# EAGLE design ionode (EAGLE 7.3.0)
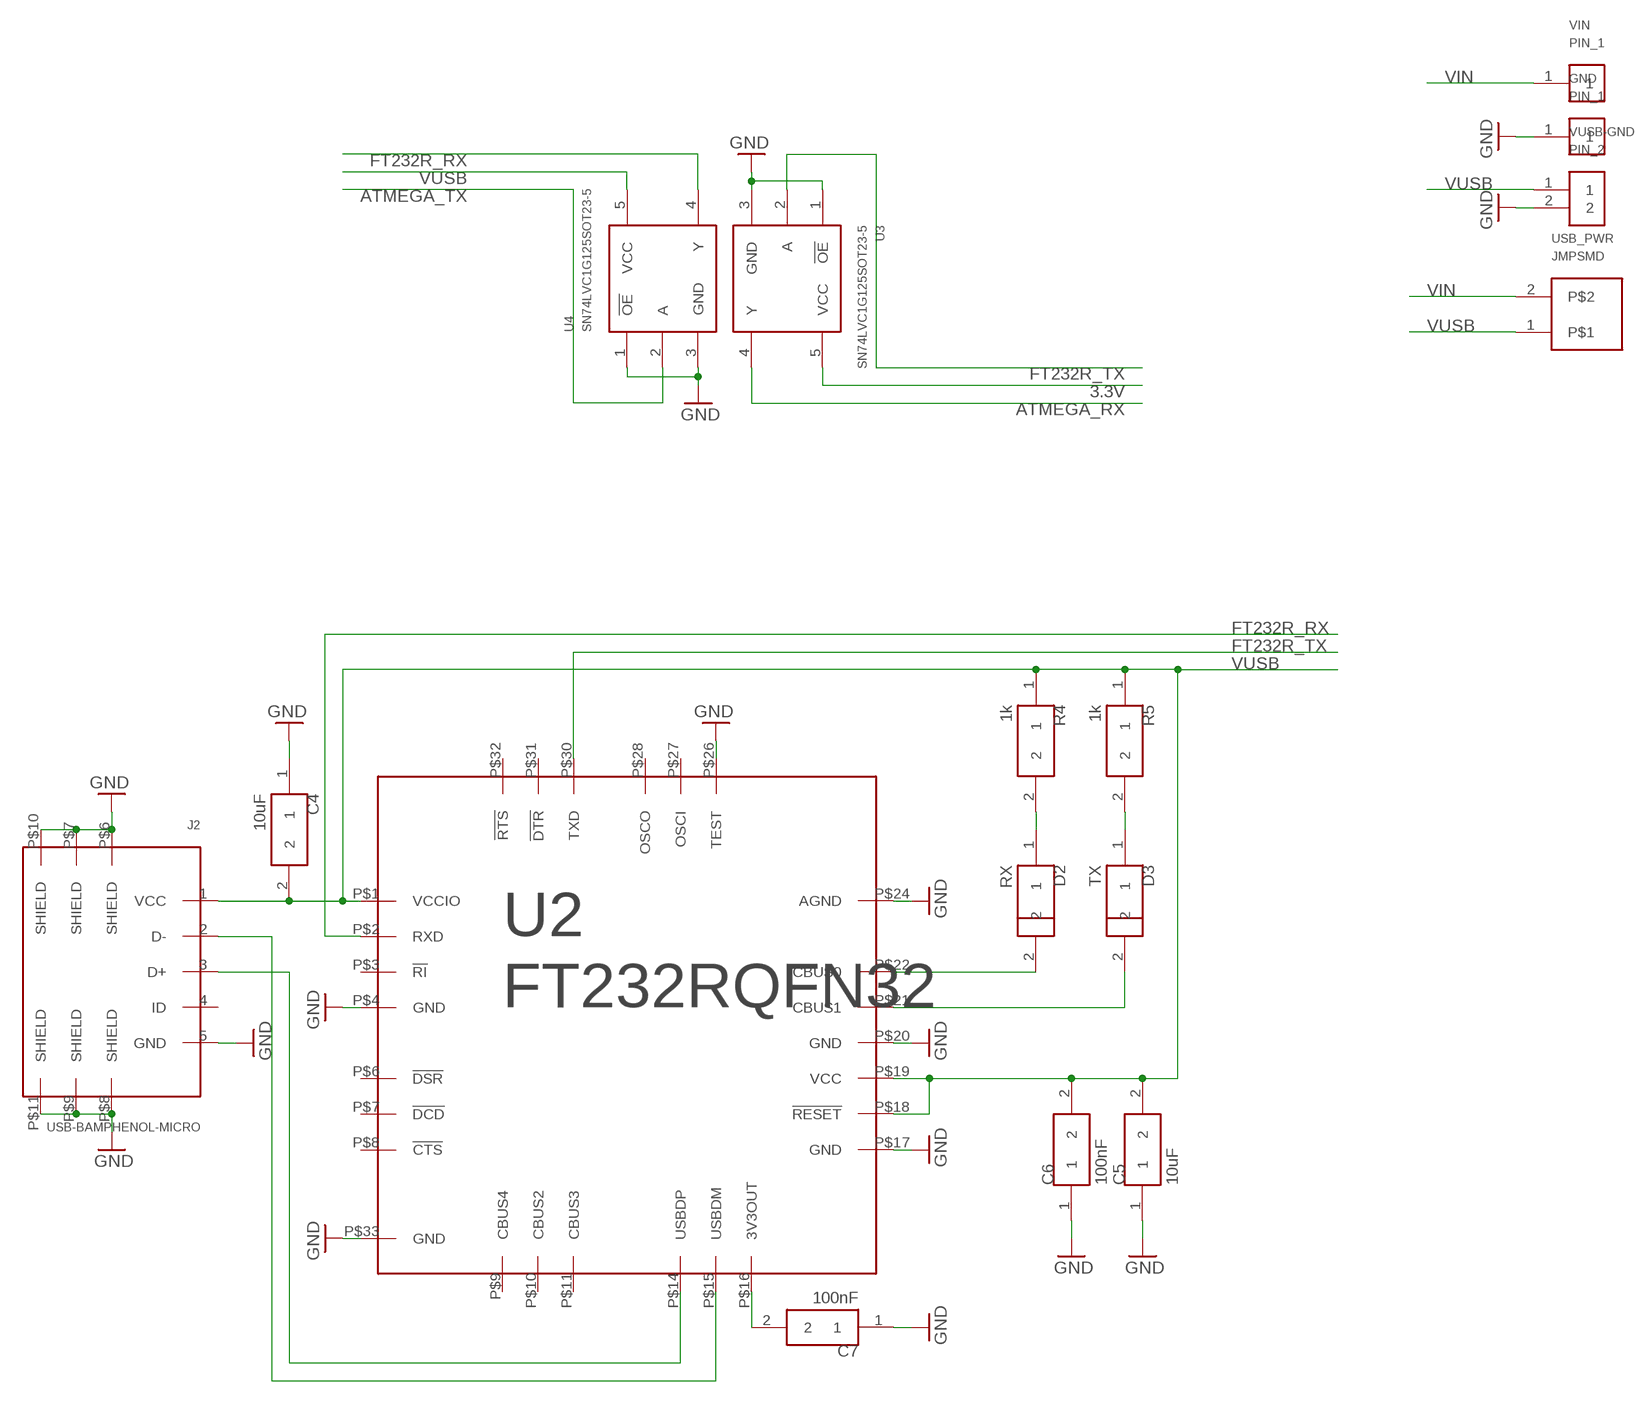
[diagram p0: schematic, sheet 1, part 1 of 2]
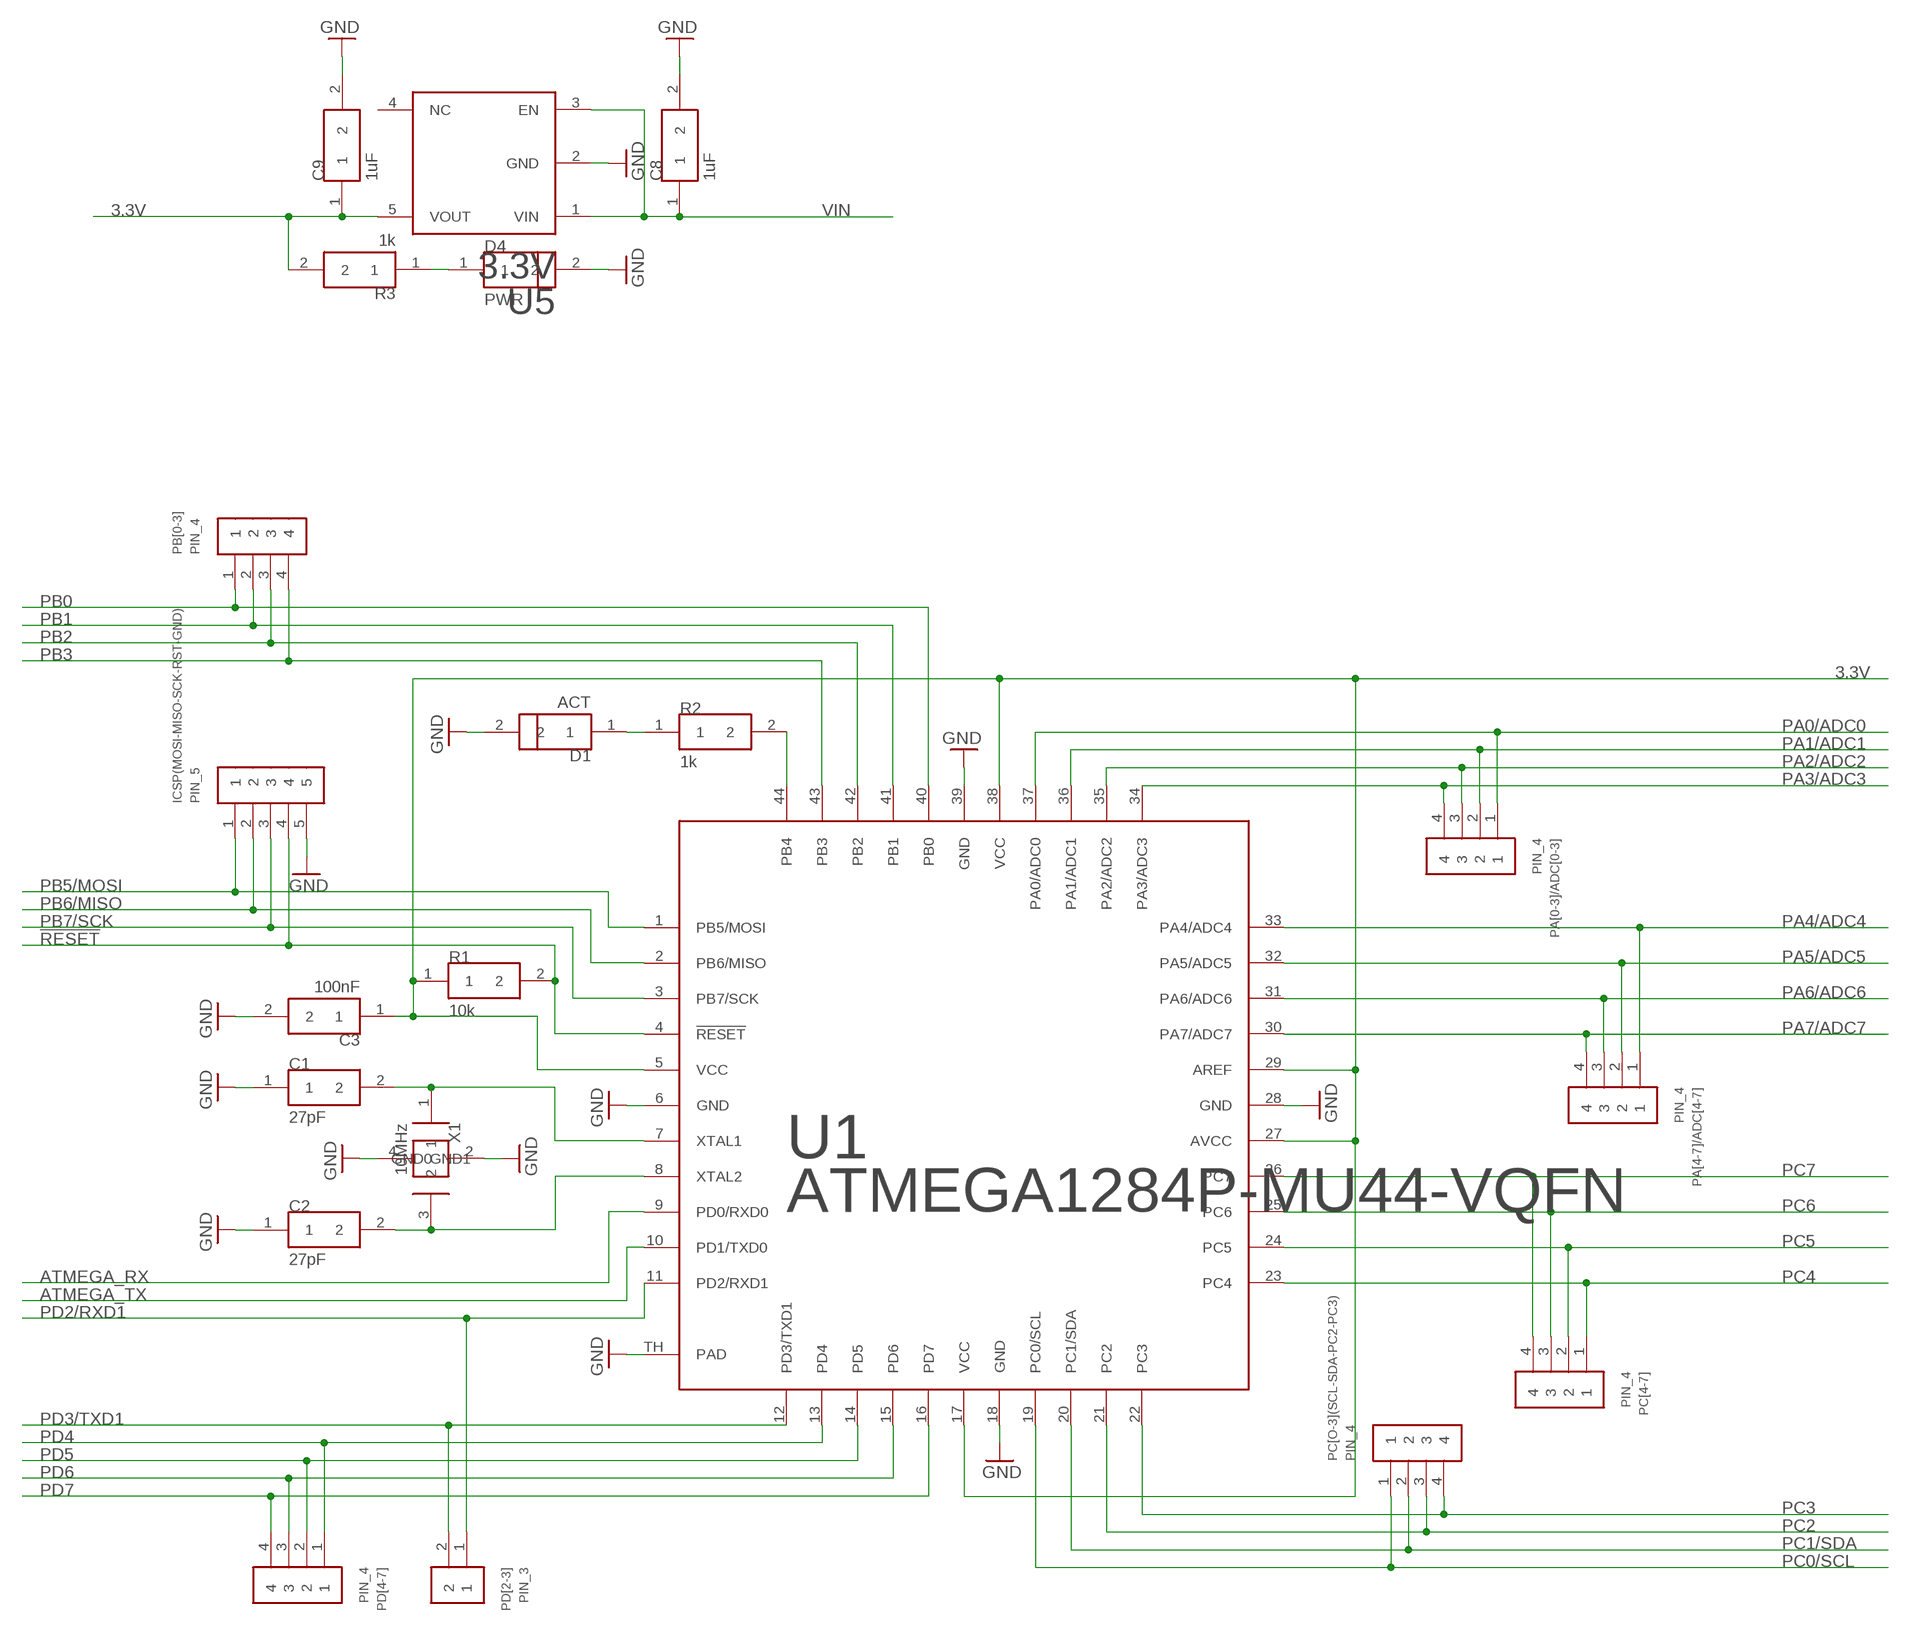
[diagram p1: schematic, sheet 1, part 2 of 2]

## Parts
C1  27pF  CAP0402  [0402]
C2  27pF  CAP0402  [0402]
C3  100nF  CAP0402  [0402]
C4  10uF  CAP0805  [0805]
C5  10uF  CAP0805  [0805]
C6  100nF  CAP0402  [0402]
C7  100nF  CAP0402  [0402]
C8  1uF  CAP0402  [0402]
C9  1uF  CAP0402  [0402]
D1  ACT  LED0402  [0402]
D2  RX  LED0402  [0402]
D3  TX  LED0402  [0402]
D4  PWR  LED0402  [0402]
GND  PIN_1  [PIN_1]
ICSP(MOSI-MISO-SCK-RST-GND)  PIN_5  [PIN_5]
J2  USB-BAMPHENOL-MICRO  [AMPHENOL-USB-MICRO-B]
PA[0-3]/ADC[0-3]  PIN_4  [PIN_4]
PA[4-7]/ADC[4-7]  PIN_4  [PIN_4]
PB[0-3]  PIN_4  [PIN_4]
PC[4-7]  PIN_4  [PIN_4]
PC[O-3](SCL-SDA-PC2-PC3)  PIN_4  [PIN_4]
PD[4-7]  PIN_4  [PIN_4]
PIN_3  PD[2-3]  PIN_2  [PIN_2]
R1  10k  RES0402  [0402]
R2  1k  RES0402  [0402]
R3  1k  RES0402  [0402]
R4  1k  RES0402  [0402]
R5  1k  RES0402  [0402]
U1  ATMEGA1284P-MU44-VQFN  [44-VQFN]
U2  FT232RQFN32  [32-VQFN]
U3  SN74LVC1G125SOT23-5  [SOT23-5]
U4  SN74LVC1G125SOT23-5  [SOT23-5]
U5  3.3V  LP3985SOT23-5  [SOT23-5]
USB_PWR  JMPSMD  [SMD_JMP]
VIN  PIN_1  [PIN_1]
VUSB-GND  PIN_2  [PIN_2]
X1  10MHz  XTAL_GNDSMD_3225  [XTAL_3225]

## Nets
3.3V: C3.1 C9.1 R1.1 R3.2 U1.5(VCC) U1.17(VCC) U1.27(AVCC) U1.29(AREF) U1.38(VCC) U3.5(VCC) U5.5(VOUT)
!RESET: ICSP(MOSI-MISO-SCK-RST-GND).4 R1.2 U1.4(!RESET)
ATMEGA_RX: U1.9(PD0/RXD0) U3.4(Y)
ATMEGA_TX: U1.10(PD1/TXD0) U4.2(A)
FT232R_RX: U2.P$2(RXD) U4.4(Y)
FT232R_TX: U2.P$30(TXD) U3.2(A)
GND: C1.1 C2.1 C3.2 C4.1 C5.1 C6.1 C7.1 C8.2 C9.2 D1.2 D4.2 GND.1 ICSP(MOSI-MISO-SCK-RST-GND).5 J2.5(GND) J2.P$6(SHIELD) J2.P$7(SHIELD) J2.P$8(SHIELD) J2.P$9(SHIELD) J2.P$10(SHIELD) J2.P$11(SHIELD) U1.6(GND) U1.18(GND) U1.28(GND) U1.39(GND) U1.TH(PAD) U2.P$4(GND) U2.P$17(GND) U2.P$20(GND) U2.P$24(AGND) U2.P$26(TEST) U2.P$33(GND) U3.1(!OE) U3.3(GND) U4.1(!OE) U4.3(GND) U5.2(GND) VUSB-GND.2 X1.2(GND0) X1.4(GND1)
N$1: C2.2 U1.8(XTAL2) X1.3
N$2: C1.2 U1.7(XTAL1) X1.1
N$3: D4.1 R3.1
N$5: D1.1 R2.1
N$6: R2.2 U1.44(PB4)
N$21: C7.2 U2.P$16(3V3OUT)
N$22: D2.2 U2.P$22(CBUS0)
N$23: D3.2 U2.P$21(CBUS1)
N$24: D2.1 R4.2
N$25: D3.1 R5.2
N$26: J2.2(D-) U2.P$15(USBDM)
N$27: J2.3(D+) U2.P$14(USBDP)
PA0/ADC0: PA[0-3]/ADC[0-3].1 U1.37(PA0/ADC0)
PA1/ADC1: PA[0-3]/ADC[0-3].2 U1.36(PA1/ADC1)
PA2/ADC2: PA[0-3]/ADC[0-3].3 U1.35(PA2/ADC2)
PA3/ADC3: PA[0-3]/ADC[0-3].4 U1.34(PA3/ADC3)
PA4/ADC4: PA[4-7]/ADC[4-7].1 U1.33(PA4/ADC4)
PA5/ADC5: PA[4-7]/ADC[4-7].2 U1.32(PA5/ADC5)
PA6/ADC6: PA[4-7]/ADC[4-7].3 U1.31(PA6/ADC6)
PA7/ADC7: PA[4-7]/ADC[4-7].4 U1.30(PA7/ADC7)
PB0: PB[0-3].1 U1.40(PB0)
PB1: PB[0-3].2 U1.41(PB1)
PB2: PB[0-3].3 U1.42(PB2)
PB3: PB[0-3].4 U1.43(PB3)
PB5/MOSI: ICSP(MOSI-MISO-SCK-RST-GND).1 U1.1(PB5/MOSI)
PB6/MISO: ICSP(MOSI-MISO-SCK-RST-GND).2 U1.2(PB6/MISO)
PB7/SCK: ICSP(MOSI-MISO-SCK-RST-GND).3 U1.3(PB7/SCK)
PC0/SCL: PC[O-3](SCL-SDA-PC2-PC3).1 U1.19(PC0/SCL)
PC1/SDA: PC[O-3](SCL-SDA-PC2-PC3).2 U1.20(PC1/SDA)
PC2: PC[O-3](SCL-SDA-PC2-PC3).3 U1.21(PC2)
PC3: PC[O-3](SCL-SDA-PC2-PC3).4 U1.22(PC3)
PC4: PC[4-7].1 U1.23(PC4)
PC5: PC[4-7].2 U1.24(PC5)
PC6: PC[4-7].3 U1.25(PC6)
PC7: PC[4-7].4 U1.26(PC7)
PD2/RXD1: PIN_3.1 U1.11(PD2/RXD1)
PD3/TXD1: PIN_3.2 U1.12(PD3/TXD1)
PD4: PD[4-7].1 U1.13(PD4)
PD5: PD[4-7].2 U1.14(PD5)
PD6: PD[4-7].3 U1.15(PD6)
PD7: PD[4-7].4 U1.16(PD7)
VIN: C8.1 U5.1(VIN) U5.3(EN) USB_PWR.2 VIN.1
VUSB: C4.2 C5.2 C6.2 J2.1(VCC) R4.1 R5.1 U2.P$1(VCCIO) U2.P$18(!RESET) U2.P$19(VCC) U4.5(VCC) USB_PWR.1 VUSB-GND.1
Unconnected: J2.4(ID) U2.P$3(!RI) U2.P$6(!DSR) U2.P$7(!DCD) U2.P$8(!CTS) U2.P$9(CBUS4) U2.P$10(CBUS2) U2.P$11(CBUS3) U2.P$27(OSCI) U2.P$28(OSCO) U2.P$31(!DTR) U2.P$32(!RTS) U5.4(NC)

## Library data of the parts
C1-C9 = dooba:CAP
D1-D4 = dooba:LED
GND VIN = dooba:PIN_1
ICSP(MOSI-MISO-SCK-RST-GND) = dooba:PIN_5
J2 = dooba:USB-B
PA[0-3]/ADC[0-3] PA[4-7]/ADC[4-7] PB[0-3] PC[4-7] PC[O-3](SCL-SDA-PC2-PC3) PD[4-7] = dooba:PIN_4
PIN_3 VUSB-GND = dooba:PIN_2
R1-R5 = dooba:RES
U1 = dooba:ATMEGA1284P-MU
U2 = dooba:FT232R
U3 U4 = dooba:SN74LVC1G125
U5 = dooba:LP3985
USB_PWR = dooba:JMP
X1 = dooba:XTAL_GND

## Board
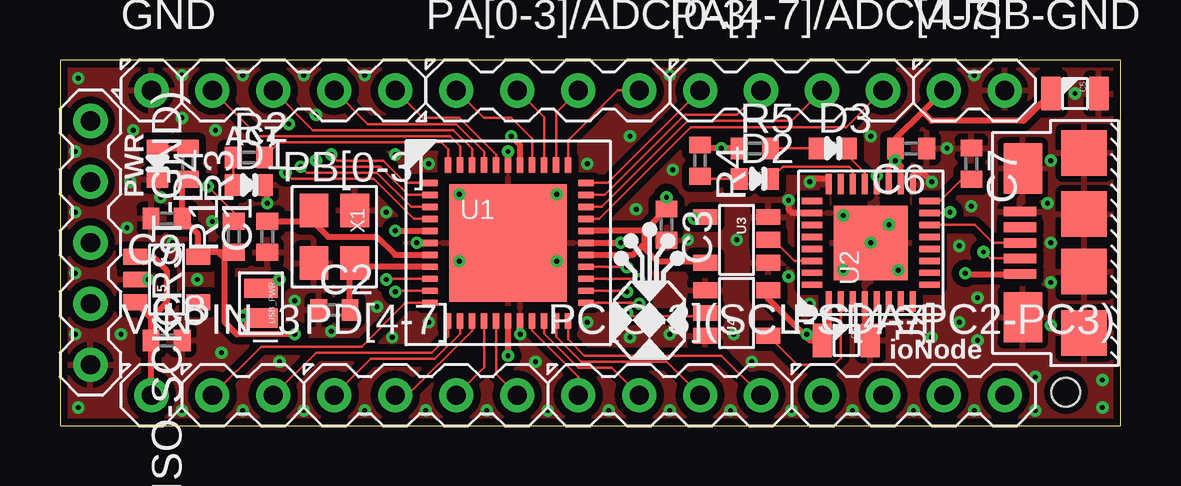
[diagram p2: board, top side]
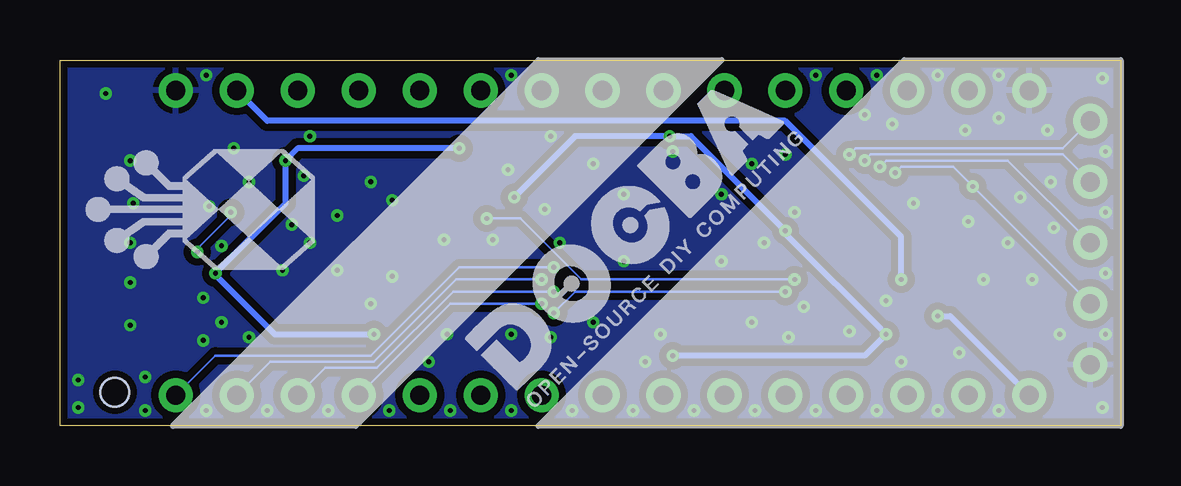
[diagram p3: board, bottom side, seen from below]

Size 44.2 x 15.24 mm. Coordinates in mm from the lower left corner, seen from the top.
Outline: 0,15.24 0,0 44.2,0 44.2,15.24 0,15.24
Copper layers (1*16): Top 0.035mm / dielectric 1.5mm / Bottom 0.035mm
Design rules "dooba-zfpcba *": minimum track width 4mil, minimum drill 8mil, track to track 4mil, track to pad 4mil, pad to pad 4mil, via to via 4mil, smd to smd 0mil, copper to edge 10mil, drill to drill 10mil, minimum pad ring 5mil, minimum via ring 6mil, stop-mask expansion 2mil, vias tented up to drill 25mil, thermal gap 10mil
Holes 1.2 mm at 41.91,1.4

### Footprints (pad centres in the part's own frame; a part is rotated, then mirrored left to right if it is on the bottom)
0402 = smd 0.7 x 0.9: 1 -0.65,0; 2 0.65,0
0805 = smd 0.8 x 1.4: 1 -1,0; 2 1,0
PIN_1 = drill 0.8 pad 1.422: 1 0,0
PIN_5 = drill 0.8 pad 1.422: 1 -5.08,0; 2 -2.54,0; 3 0,0; 4 2.54,0; 5 5.08,0
AMPHENOL-USB-MICRO-B = smd 0.4 x 1.35: 1 -1.3,2.675; 2 -0.65,2.675; 3 0,2.675; 4 0.65,2.675; 5 1.3,2.675 | smd 1.9 x 1.9: P$6 -1.2,0; P$7 1.2,0; P$8 -3.75,0; P$9 3.75,0 | smd 2.1 x 1.6: P$10 -3.1,2.55; P$11 3.1,2.55
PIN_4 = drill 0.8 pad 1.422: 1 -3.81,0; 2 -1.27,0; 3 1.27,0; 4 3.81,0
PIN_2 = drill 0.8 pad 1.422: 1 -1.27,0; 2 1.27,0
44-VQFN = smd 0.65 x 0.26: 1 -3.25,2.5; 2 -3.25,2; 3 -3.25,1.5; 4 -3.25,1; 5 -3.25,0.5; 6 -3.25,0; 7 -3.25,-0.5; 8 -3.25,-1; 9 -3.25,-1.5; 10 -3.25,-2; 11 -3.25,-2.5; 23 3.25,-2.5; 24 3.25,-2; 25 3.25,-1.5; 26 3.25,-1; 27 3.25,-0.5; 28 3.25,0; 29 3.25,0.5; 30 3.25,1; 31 3.25,1.5; 32 3.25,2; 33 3.25,2.5 | smd 0.26 x 0.65: 12 -2.5,-3.25; 13 -2,-3.25; 14 -1.5,-3.25; 15 -1,-3.25; 16 -0.5,-3.25; 17 0,-3.25; 18 0.5,-3.25; 19 1,-3.25; 20 1.5,-3.25; 21 2,-3.25; 22 2.5,-3.25; 34 2.5,3.25; 35 2,3.25; 36 1.5,3.25; 37 1,3.25; 38 0.5,3.25; 39 0,3.25; 40 -0.5,3.25; 41 -1,3.25; 42 -1.5,3.25; 43 -2,3.25; 44 -2.5,3.25 | smd 4.9 x 4.9: TH 0,0
32-VQFN = smd 0.85 x 0.26: P$1 -2.45,1.75; P$2 -2.45,1.25; P$3 -2.45,0.75; P$4 -2.45,0.25; P$5 -2.45,-0.25; P$6 -2.45,-0.75; P$7 -2.45,-1.25; P$8 -2.45,-1.75; P$17 2.45,-1.75; P$18 2.45,-1.25; P$19 2.45,-0.75; P$20 2.45,-0.25; P$21 2.45,0.25; P$22 2.45,0.75; P$23 2.45,1.25; P$24 2.45,1.75 | smd 0.26 x 0.85: P$9 -1.75,-2.45; P$10 -1.25,-2.45; P$11 -0.75,-2.45; P$12 -0.25,-2.45; P$13 0.25,-2.45; P$14 0.75,-2.45; P$15 1.25,-2.45; P$16 1.75,-2.45; P$25 1.75,2.45; P$26 1.25,2.45; P$27 0.75,2.45; P$28 0.25,2.45; P$29 -0.25,2.45; P$30 -0.75,2.45; P$31 -1.25,2.45; P$32 -1.75,2.45 | smd 3.1 x 3.1: P$33 0,0
SOT23-5 = smd 0.66 x 1: 1 0.95,1.315; 2 0,1.315; 3 -0.95,1.315; 4 -0.95,-1.315; 5 0.95,-1.315
SMD_JMP = smd 0.8 x 1.4: 1 -0.619,0; 2 0.619,0
XTAL_3225 = smd 1.4 x 1.2: 1 -1.1,-0.85; 2 1.1,-0.85; 3 1.1,0.85; 4 -1.1,0.85

### Placement (x,y rotation side)
C1  8.64,7.87 90 top
C2  11.43,4.83 0 top
C3  25.27,8.38 270 top
C4  32.77,3.56 180 top
C5  42.29,13.84 180 top
C6  35.46,11.56 180 top
C7  37.97,10.92 270 top
C8  4.45,3.56 0 top
C9  4.45,8.64 180 top
D1  7.87,10.03 0 top
D2  28.96,10.29 0 top
D3  32.21,11.56 0 top
D4  4.06,10.92 270 top
GND  3.81,13.97 0 top
ICSP(MOSI-MISO-SCK-RST-GND)  1.27,7.62 270 top
J2  42.67,7.62 90 top
PA[0-3]/ADC[0-3]  20.32,13.97 0 top
PA[4-7]/ADC[4-7]  30.48,13.97 0 top
PB[0-3]  10.16,13.97 180 top
PC[4-7]  35.56,1.27 0 top
PC[O-3](SCL-SDA-PC2-PC3)  25.4,1.27 0 top
PD[4-7]  15.24,1.27 0 top
PIN_3  7.62,1.27 0 top
R1  7.24,7.87 90 top
R2  7.87,11.18 0 top
R3  5.33,10.92 270 top
R4  26.67,11.05 270 top
R5  28.96,11.56 0 top
U1  18.67,7.62 0 top
U2  33.78,7.62 90 top
U3  28.19,7.75 270 top
U4  28.19,4.7 90 top
U5  4.45,6.1 90 top
USB_PWR  8.37,5.11 270 top
VIN  3.81,1.27 0 top
VUSB-GND  38.1,13.97 0 top
X1  11.43,7.87 270 top

### Tracks (layer width: path | path; a pad name or v marks a point on that pad's centre or on a via)
3.3V  (via drill 0.2)
  Top 0.254: 26.71,6.97 U3.5 26.82,6.86 24.89,6.86 24.36,7.39 24.36,7.6 | R1.1 6.6,7.22 | 6.6,7.22 5.94,7.22 U5.5 5.76,7.97 C9.1 5.09,10.16 R3.2 | v13.97,8.13 v13.98,8.12 U1.5 | v18.67,2.92 U1.17 | U1.38 19.17,11.69 v18.8,12.07 | v25.27,9.52 C3.1 24.36,8.12 | 24.36,8.12 U1.29 | U1.27 23.88,7.12 24.36,7.6 | 24.36,7.6 24.36,8.12 | v9.78,3.81 7.37,3.81 6.86,4.32 6.86,6.97 6.6,7.22
  Bottom 0.254: v18.67,2.92 10.67,2.92 v9.78,3.81 13.97,8 v13.97,8.13 17.91,12.07 v18.8,12.07 22.73,12.07 v25.27,9.52
!RESET  (via drill 0.2)
  Top 0.102: U1.4 14.75,8.62 13.08,10.29 9.65,10.29 v9.4,10.54 | R1.2 7.24,8.89 v6.16,9.97
  Bottom 0.102: v9.4,10.54 9.14,10.8 6.98,10.8 6.29,10.1 v6.16,9.97 ICSP(MOSI-MISO-SCK-RST-GND).4
ATMEGA_RX  (via drill 0.2)
  Top 0.102: U1.9 13.61,6.12 v13.59,6.1 | v26.42,8.64 26.82,8.64 U3.4
  Bottom 0.102: v13.59,6.1 22.48,6.1 25.02,8.64 v26.42,8.64
ATMEGA_TX  (via drill 0.2)
  Top 0.102: U1.10 14,5.62 v13.97,5.59 | v23.62,4.7 23.75,4.57 26.75,4.57 U4.2
  Bottom 0.102: v13.97,5.59 22.73,5.59 v23.62,4.7
FT232R_RX
  Top 0.102: U2.P$2 32.53,2.81 32.26,2.54 30.72,2.54 U4.4
FT232R_TX
  Top 0.102: U2.P$30 30.59,6.87 29.97,7.49 29.76,7.49 U3.2
GND  (via drill 0.2)
  Top 0.254: U1.28 v23.37,7.62 | U5.2 v3.68,6.1 | U1.39 v18.67,11.43 | U1.18 v19.17,3.82 v19.18,3.81 | U1.6 v14.86,7.62 | 30.86,8.89 30.88,8.87 U2.P$26 30.5,8.87 30.35,9.02 v30.35,9.4 | U2.P$24 32.03,10.26 32,10.29 31.37,10.29 | U2.P$20 v34.03,10.41 v34.04,10.41 | U2.P$17 35.53,10.39 35.69,10.54 35.94,10.54 v36.32,10.16 | U2.P$4 33.53,4.7 | 33.53,4.7 | v8.64,9.27 8.64,9.92 D1.2 | U1.TH 17.4,7.62 v16.64,6.86 | 33.53,4.7 33.53,3.79 C4.1
  other vias: 32.64,6.48 34.92,6.48 32.64,8.76 34.54,8.38 33.78,7.62 16.64,9.65 20.7,9.65 20.7,6.86 0.76,14.48 0.76,0.76 43.43,0.76 0.64,11.43 0.64,8.89 0.64,6.35 0.64,3.81 3.05,12.32 2.92,10.16 2.79,8.26 2.54,3.81 6.73,3.05 9.78,5.21 13.21,4.95 11.3,3.94 13.84,3.68 13.59,8.89 13.97,11.3 9.52,12.57 6.48,12.32 5.08,12.83 5.08,14.61 7.62,14.61 10.16,14.61 12.7,14.61 25.4,14.61 38.1,14.61 42.29,13.84 5.08,0.64 7.62,0.64 10.16,0.64 12.7,0.64 15.24,0.64 17.78,0.64 20.32,0.64 22.86,0.64 25.4,0.64 27.94,0.64 30.48,0.64 33.02,0.64 35.56,0.64 38.1,0.64 40.64,0.64 40.64,2.03 4.19,9.52 4.7,7.62 5.71,6.1 6.35,8.51 15.37,4.32 21.97,4.32 21.97,10.92 15.37,10.92 23.75,12.07 25.53,10.67 24,9.02 26.16,7.75 25.4,3.81 23.75,3.68 19.81,2.67 9.14,2.67 10.67,12.95 28.83,2.67 28.19,7.75 28.07,3.81 31.24,10.16 31.24,5.08 33.78,12.07 36.96,11.56 37.97,9.14 37.47,7.49 30.35,6.22 36.32,3.68 38.23,5.33 38.23,3.56 37.47,4.32 43.43,1.91 41.28,7.62 41.28,11.05 41.28,4.19 41.28,5.97 41.15,9.27
  pour Top (isolate 0.305): 44.2,15.24 44.2,0 0,0 0,15.24
  pour Bottom (isolate 0.305): 44.2,15.24 44.2,0 0,0 0,15.24
N$1
  Top 0.254: U1.8 12.43,6.62 X1.3 12.08,6.57 C2.2
N$2
  Top 0.254: U1.7 13.96,7.12 13.21,7.87 11.18,7.87 10.58,8.47 X1.1 10.13,8.52 C1.2
N$3
  Top 0.254: D4.1 R3.1
N$5
  Top 0.102: R2.1 D1.1
N$6
  Top 0.102: U1.44 16.17,11.52 15.88,11.81 9.14,11.81 8.76,11.43 R2.2
N$21
  Top 0.102: U2.P$16 36.67,9.37 37.58,10.27 C7.2
N$22
  Top 0.102: U2.P$22 33.03,10.66 32.89,10.8 30.11,10.8 D2.2
N$23
  Top 0.102: U2.P$21 33.53,10.54 32.86,11.21 D3.2
N$24
  Top 0.102: R4.2 26.78,10.29 D2.1
N$25
  Top 0.102: D3.1 R5.2
N$26  (via drill 0.2)
  Top 0.102: U2.P$15 37.06,8.87 v37.08,8.89 | v38.48,7.24 38.75,6.97 J2.2
  Bottom 0.102: v37.08,8.89 37.08,8.76 38.48,7.37 v38.48,7.24
N$27
  Top 0.102: U2.P$14 38.11,8.37 38.86,7.62 J2.3
PA0/ADC0
  Top 0.102: U1.37 19.67,11.95 18.8,12.83 17.65,12.83 PA[0-3]/ADC[0-3].1
PA1/ADC1
  Top 0.102: U1.36 20.17,12.85 PA[0-3]/ADC[0-3].2
PA2/ADC2
  Top 0.102: U1.35 20.67,13.05 PA[0-3]/ADC[0-3].3
PA3/ADC3
  Top 0.102: PA[0-3]/ADC[0-3].4 23.24,13.97 21.17,11.9 U1.34
PA4/ADC4
  Top 0.102: U1.33 22.82,10.12 PA[4-7]/ADC[4-7].1
PA5/ADC5
  Top 0.102: U1.32 22.7,9.62 26.04,12.95 28.19,12.95 PA[4-7]/ADC[4-7].2
PA6/ADC6
  Top 0.102: U1.31 22.58,9.12 26.16,12.7 30.48,12.7 PA[4-7]/ADC[4-7].3
PA7/ADC7
  Top 0.102: U1.30 22.46,8.62 26.29,12.45 32.77,12.45 PA[4-7]/ADC[4-7].4
PB0
  Top 0.102: U1.40 18.17,11.3 16.64,12.83 15.11,12.83 PB[0-3].1
PB1
  Top 0.102: U1.41 17.67,11.41 16.51,12.57 12.83,12.57 PB[0-3].2
PB2
  Top 0.102: U1.42 17.17,11.53 16.38,12.32 10.54,12.32 PB[0-3].3
PB3
  Top 0.102: PB[0-3].4 8.25,12.07 16.26,12.07 16.67,11.65 U1.43
PB5/MOSI  (via drill 0.2)
  Top 0.102: U1.1 14.39,10.12 13.46,11.05 11.56,11.05 v11.3,11.3
  Bottom 0.102: v11.3,11.3 11.05,11.56 2.41,11.56 ICSP(MOSI-MISO-SCK-RST-GND).1
PB6/MISO  (via drill 0.2)
  Top 0.102: U1.2 14.51,9.62 13.34,10.8 10.92,10.8 v10.67,11.05
  Bottom 0.102: v10.67,11.05 10.41,11.3 2.41,11.3 ICSP(MOSI-MISO-SCK-RST-GND).2
PB7/SCK  (via drill 0.2)
  Top 0.102: U1.3 14.63,9.12 13.21,10.54 10.29,10.54 v10.03,10.8
  Bottom 0.102: ICSP(MOSI-MISO-SCK-RST-GND).3 4.7,11.05 9.78,11.05 v10.03,10.8
PC0/SCL
  Top 0.102: U1.19 19.67,3.95 21.59,2.03 PC[O-3](SCL-SDA-PC2-PC3).1
PC1/SDA
  Top 0.102: U1.20 20.17,3.83 21.59,2.41 22.99,2.41 PC[O-3](SCL-SDA-PC2-PC3).2
PC2
  Top 0.102: U1.21 20.67,3.71 21.72,2.67 25.27,2.67 PC[O-3](SCL-SDA-PC2-PC3).3
PC3
  Top 0.102: U1.22 21.17,3.6 21.84,2.92 27.56,2.92 PC[O-3](SCL-SDA-PC2-PC3).4
PC4  (via drill 0.2)
  Top 0.102: U1.23 24.09,5.12 v24.13,5.08
  Bottom 0.102: v24.13,5.08 27.94,5.08 PC[4-7].1
PC5  (via drill 0.2)
  Top 0.102: U1.24 23.59,5.62 v23.62,5.59
  Bottom 0.102: PC[4-7].2 33.15,2.41 30.99,2.41 27.81,5.59 v23.62,5.59
PC6  (via drill 0.2)
  Top 0.102: U1.25 24.11,6.12 v24.13,6.1
  Bottom 0.102: PC[4-7].3 35.43,2.67 31.12,2.67 27.69,6.1 v24.13,6.1
PC7  (via drill 0.2)
  Top 0.102: U1.26 23.61,6.62 v23.62,6.6
  Bottom 0.102: PC[4-7].4 37.72,2.92 31.24,2.92 27.56,6.6 v23.62,6.6
PD2/RXD1
  Top 0.102: U1.11 14.39,5.12 12.57,3.3 8.38,3.3 PIN_3.1
PD3/TXD1
  Top 0.102: PIN_3.2 10.67,3.05 15.49,3.05 16.17,3.72 U1.12
PD4
  Top 0.102: U1.13 16.67,3.84 15.62,2.79 12.95,2.79 PD[4-7].1
PD5
  Top 0.102: U1.14 17.17,3.96 14.48,1.27 PD[4-7].2
PD6
  Top 0.102: U1.15 17.67,2.43 PD[4-7].3
PD7
  Top 0.102: U1.16 18.17,2.15 PD[4-7].4
VIN  (via drill 0.2)
  Top 0.254: VIN.1 3.81,3.54 C8.1 3.8,4.48 | 3.8,4.48 U5.3 | U5.1 3.88,7.05 4.45,6.48 4.45,5.13 3.8,4.48 | USB_PWR.2 7.7,4.49 v7.62,4.57
  Bottom 0.254: v7.62,4.57 7.11,4.57 VIN.1
VUSB  (via drill 0.2)
  Top 0.254: v34.8,11.05 v34.81,11.06 C6.2 34.81,11.95 35.94,13.08 | VUSB-GND.1 35.94,13.08 | C5.2 40.15,12.7 36.32,12.7 35.94,13.08 | U2.P$19 34.53,10.78 v34.8,11.05 | U2.P$18 35.03,10.82 v34.8,11.05 | U2.P$1 32.03,3.82 C4.2 | U4.5 29.51,5.29 31.24,3.56 C4.2 | v31.12,3.81 31.62,3.56 C4.2 | v37.72,6.35 37.75,6.32 J2.1 | R5.1 v27.56,11.56 26.81,11.56 R4.1 | USB_PWR.1 8.78,5.73 v9.14,6.1
  Bottom 0.254: v31.12,3.81 35.24,3.81 37.72,6.29 v37.72,6.35 34.8,9.27 v34.8,11.05 34.29,11.56 v27.56,11.56 | v9.14,6.1 9.14,7.87 13.97,12.7 35.56,12.7 VUSB-GND.1

### Text on the board
tPlace: PWR | ACT | ioNode
Refs: C5 | X1 | U3 | U2 | J1 | U1 | U5 | U4 | C4